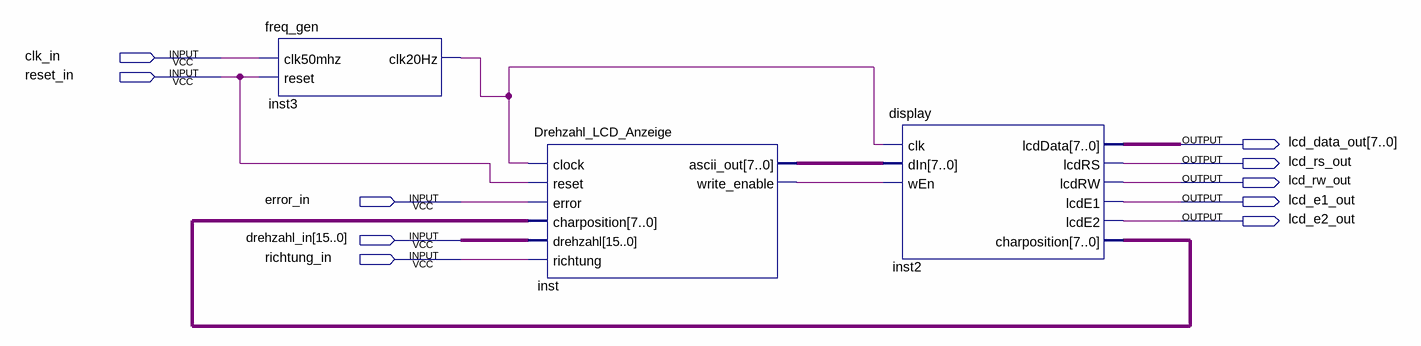
[diagram p0: schematic sheet]
// Quartus schematic Testblock_LCD_Anzeige.bdf as structural Verilog: 3 symbols, 10 pins
module Testblock_LCD_Anzeige (
  input  clk_in,
  input  reset_in,
  input  error_in,
  input  [15:0] drehzahl_in,
  input  richtung_in,
  output [7:0] lcd_data_out,
  output lcd_rs_out,
  output lcd_rw_out,
  output lcd_e1_out,
  output lcd_e2_out
);

  wire inst3_clk20hz, inst_write_enable;
  wire [7:0] inst2_charposition, inst_ascii_out;

  freq_gen inst3 (.clk50mhz(clk_in), .reset(reset_in), .clk20Hz(inst3_clk20hz));
  Drehzahl_LCD_Anzeige inst (
    .clock(inst3_clk20hz), .reset(reset_in), .error(error_in), .charposition(inst2_charposition),
    .drehzahl(drehzahl_in), .richtung(richtung_in), .ascii_out(inst_ascii_out),
    .write_enable(inst_write_enable));
  display inst2 (
    .clk(inst3_clk20hz), .dIn(inst_ascii_out), .wEn(inst_write_enable), .lcdData(lcd_data_out),
    .lcdRS(lcd_rs_out), .lcdRW(lcd_rw_out), .lcdE1(lcd_e1_out), .lcdE2(lcd_e2_out),
    .charposition(inst2_charposition));
endmodule
